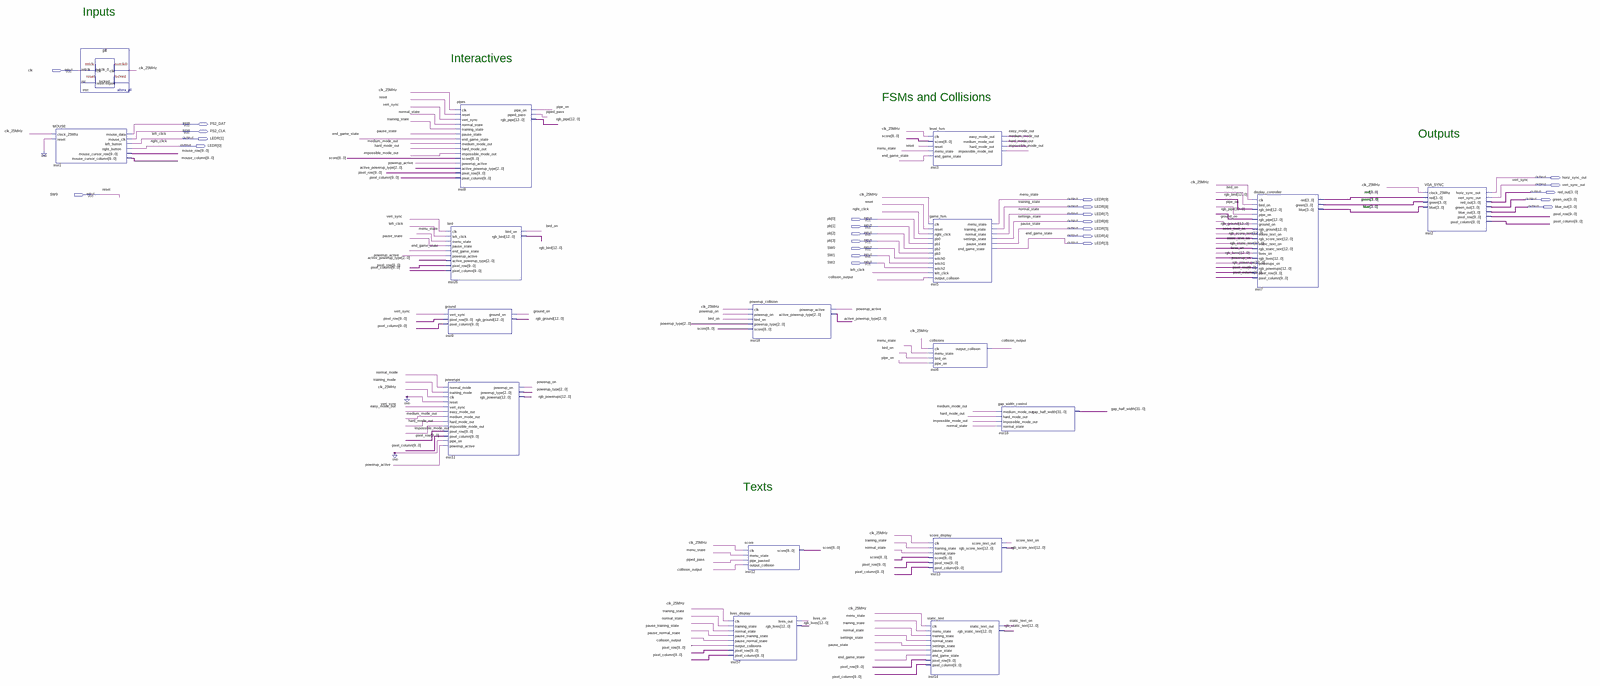
[diagram p0: schematic sheet, whole]
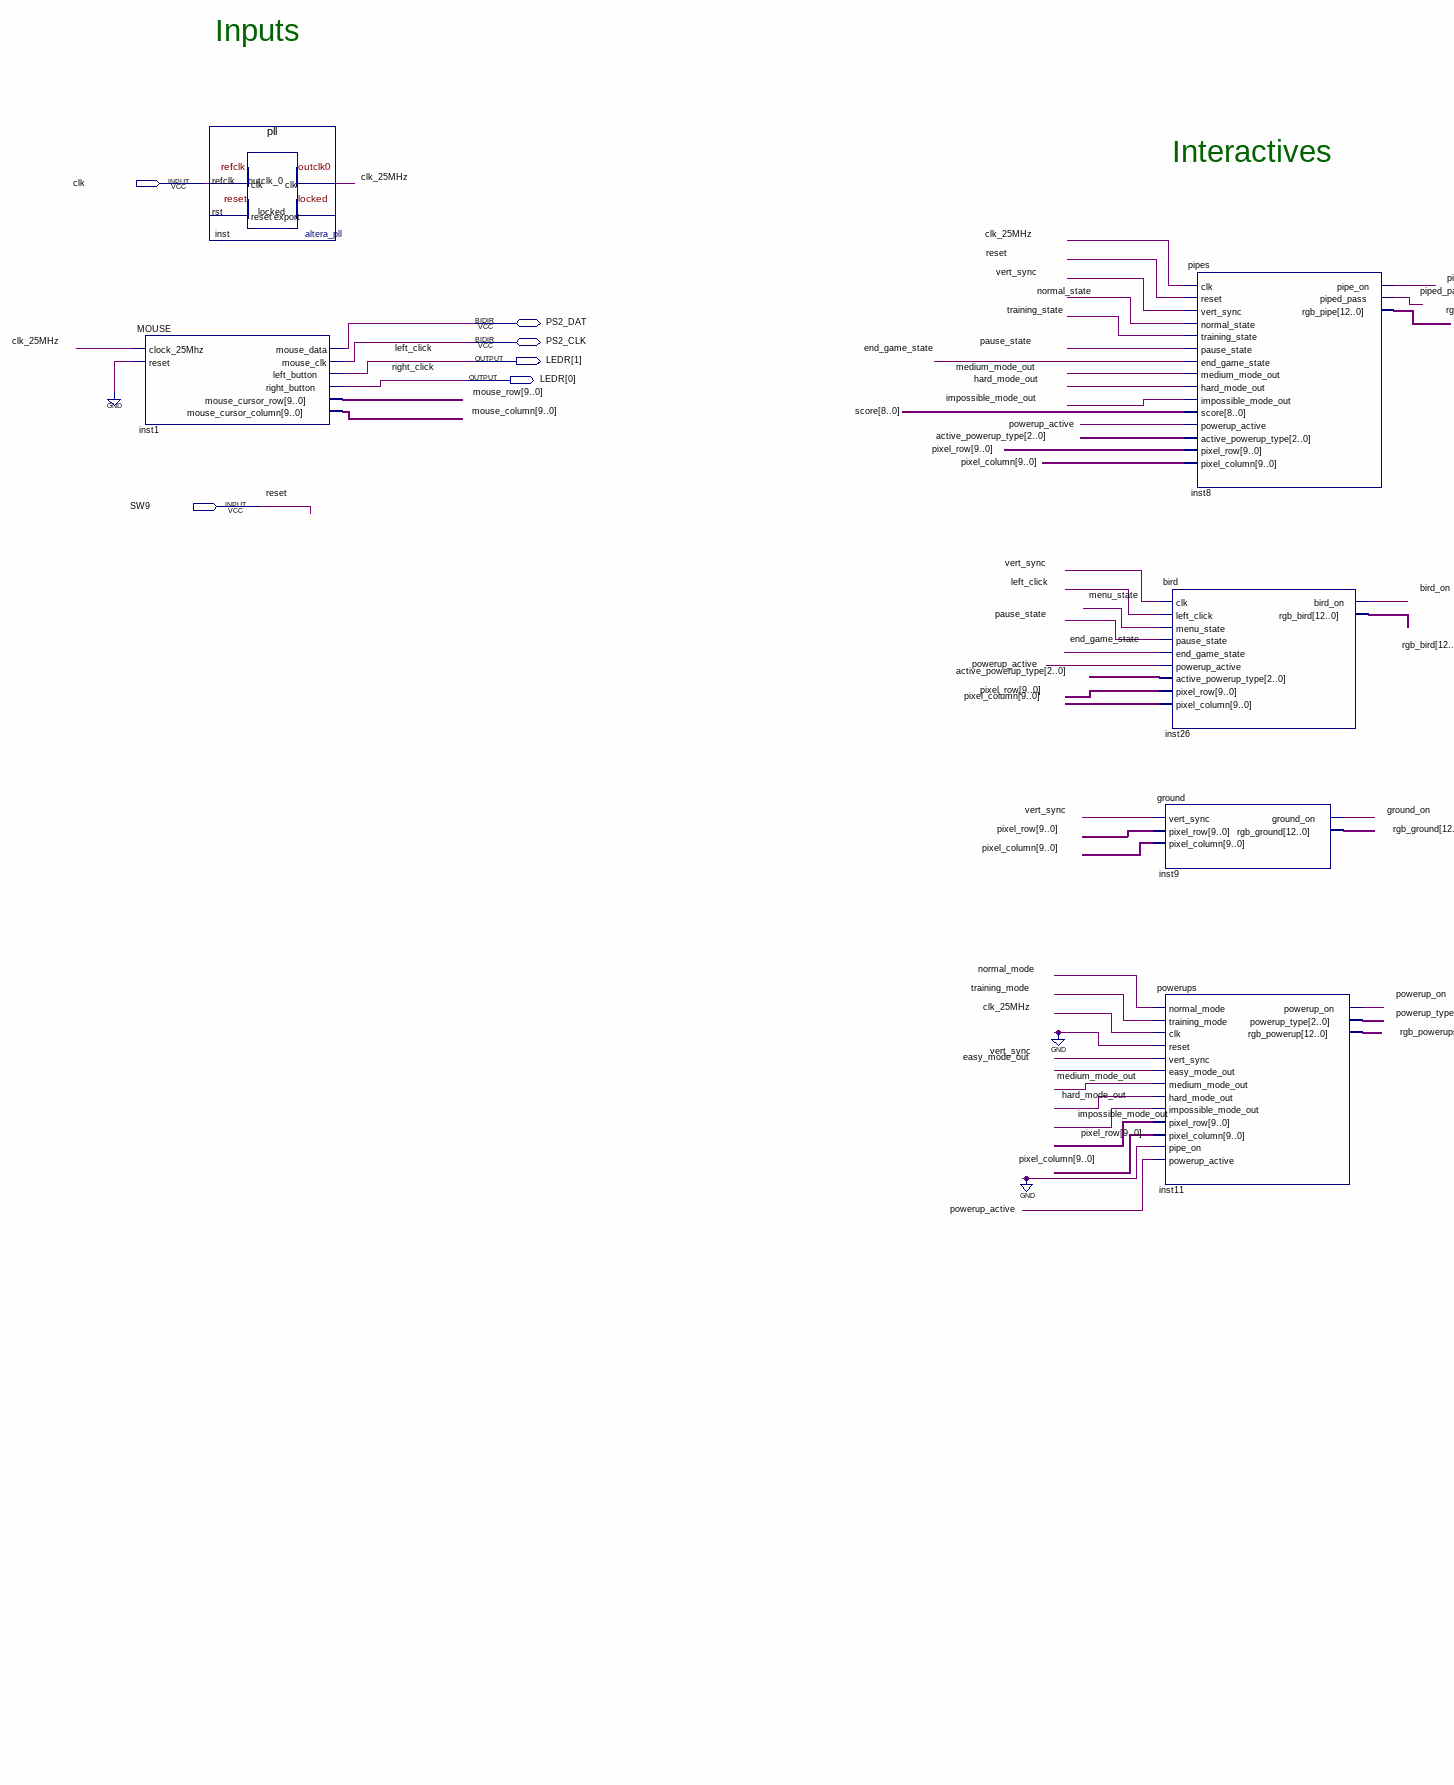
[diagram p1: schematic sheet, left part]
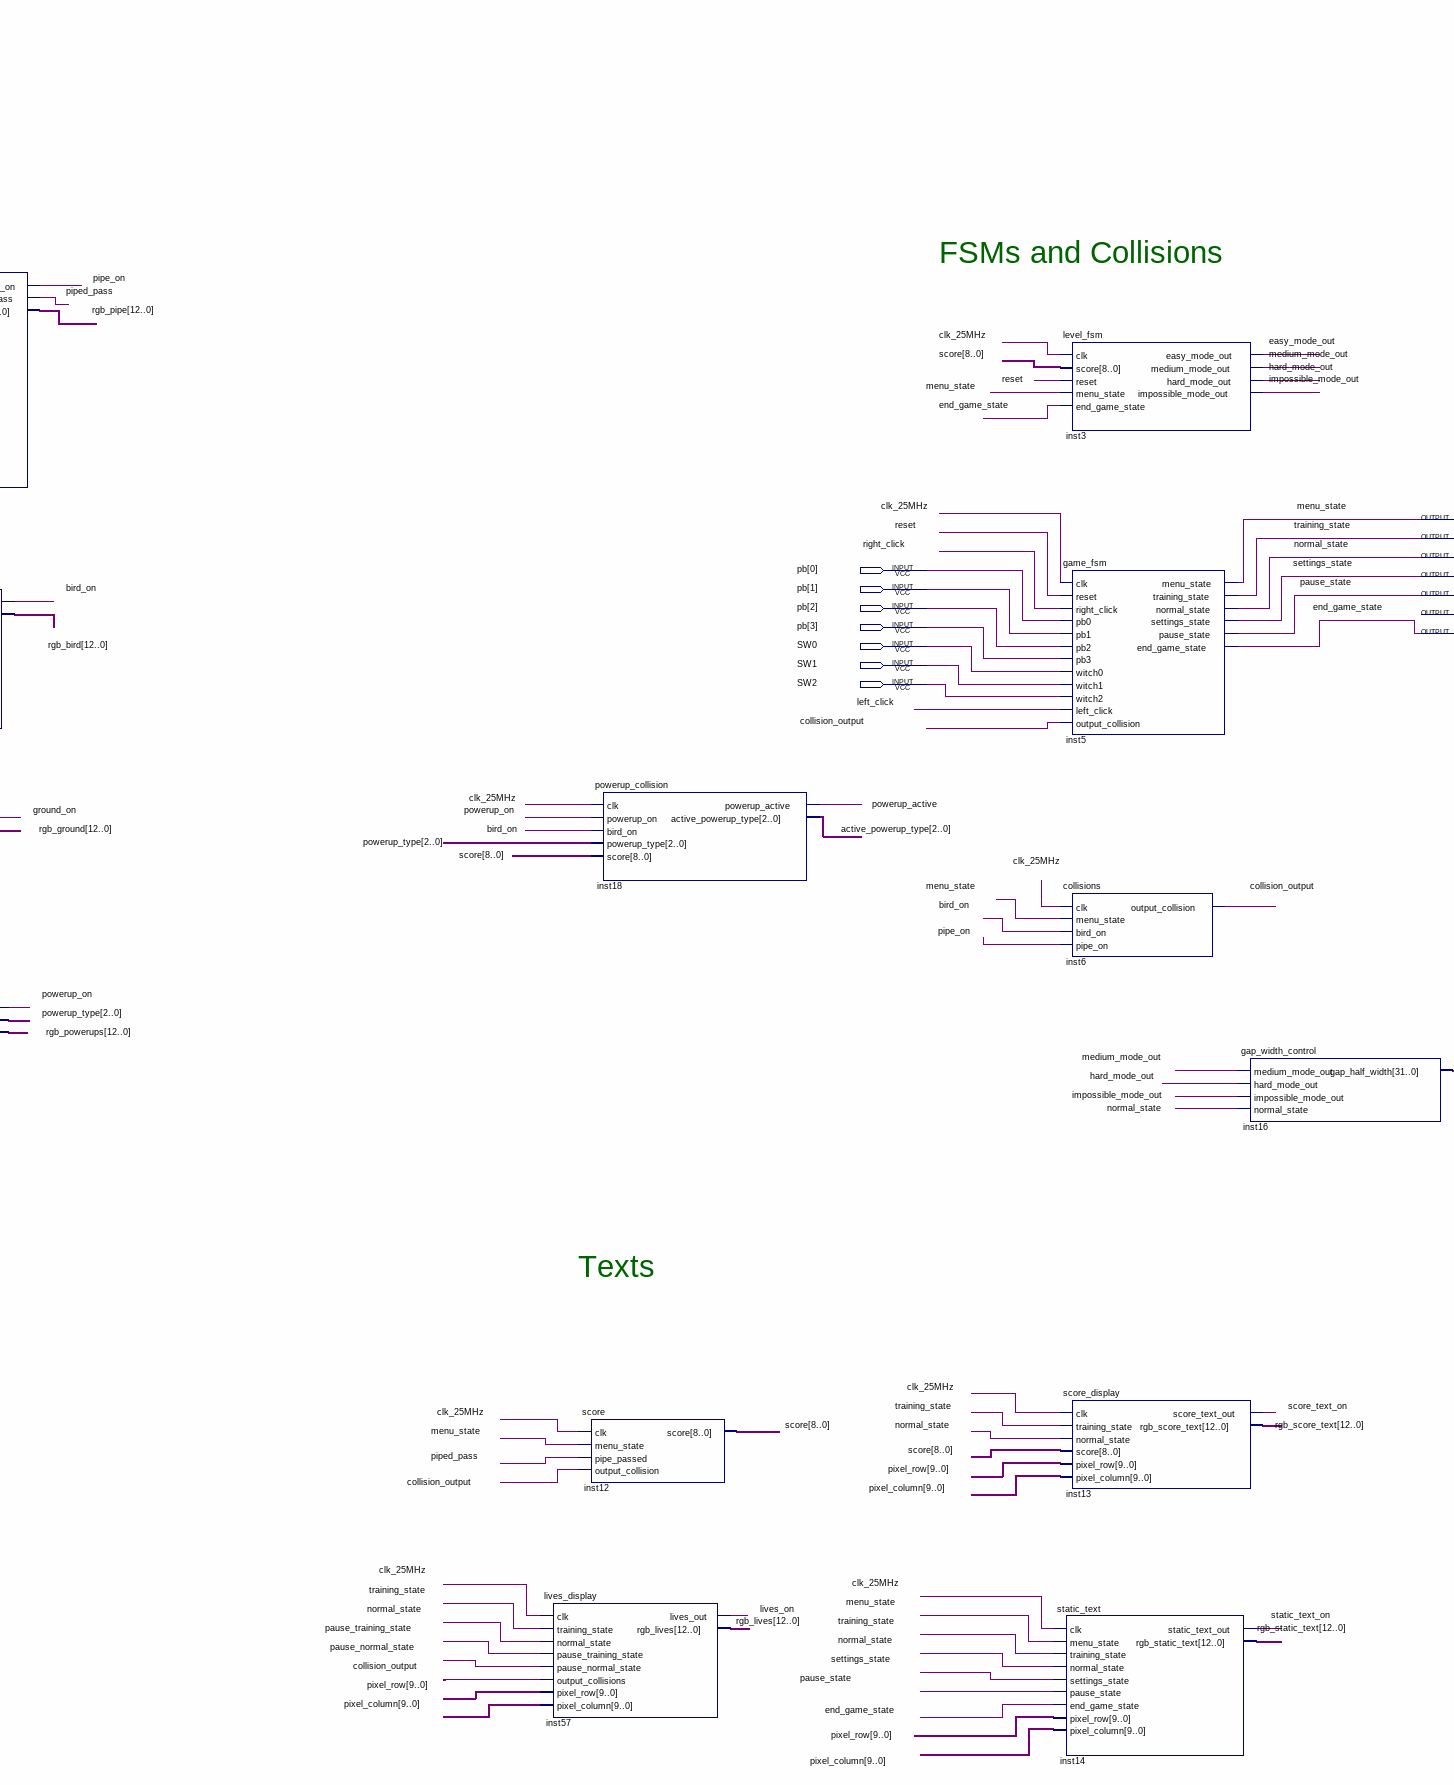
[diagram p2: schematic sheet, centre part]
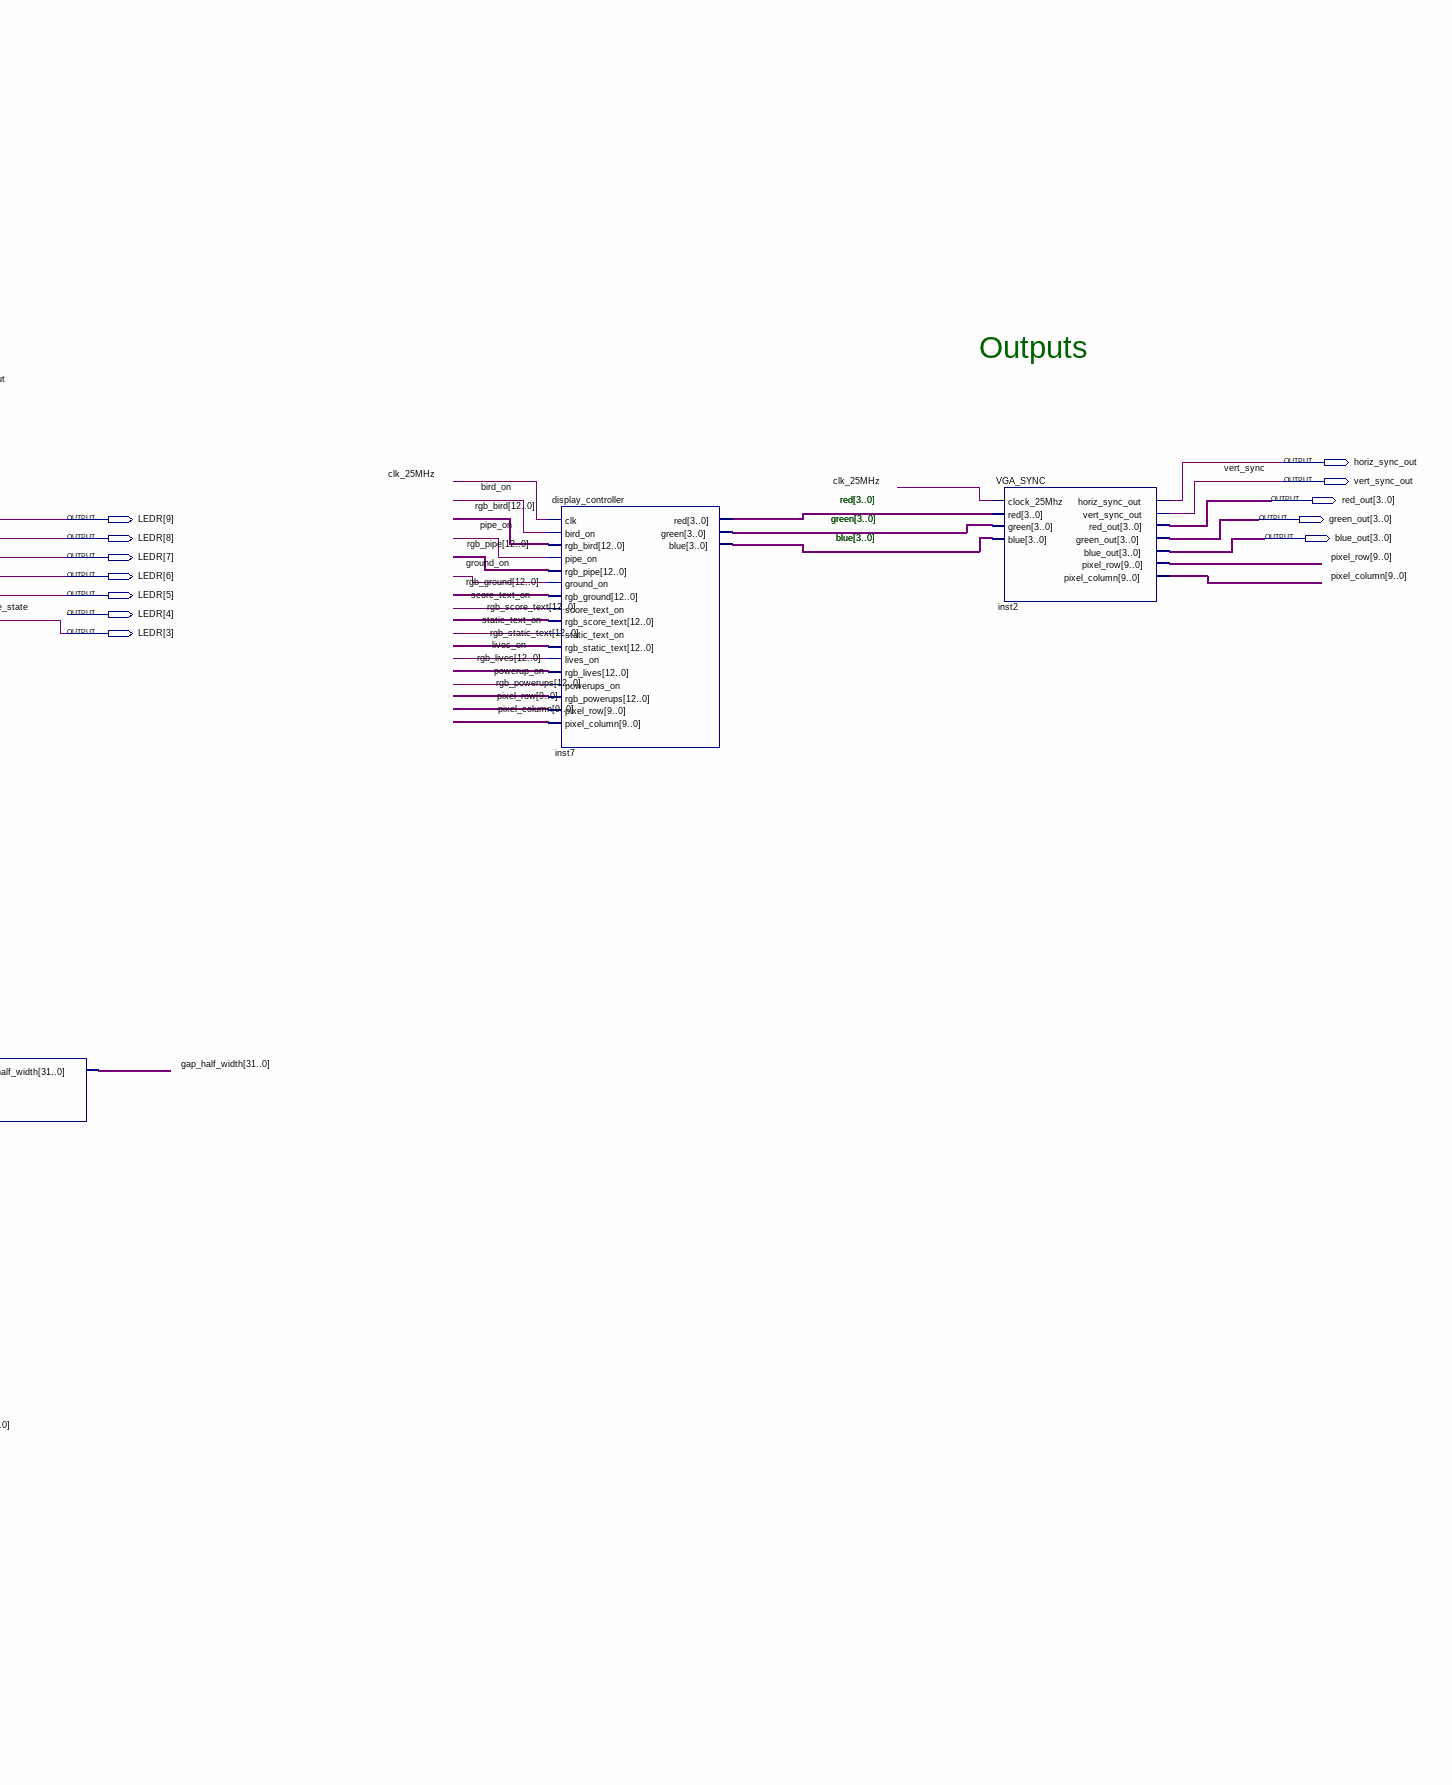
[diagram p3: schematic sheet, right part]
// Quartus schematic flappybird.bdf as structural Verilog: 17 symbols, 25 pins
module flappybird (
  input  clk,
  input  SW9,
  input  [3:0] pb,
  input  SW0,
  input  SW1,
  input  SW2,
  inout  PS2_DAT,
  inout  PS2_CLK,
  output [9:0] LEDR,
  output horiz_sync_out,
  output vert_sync_out,
  output [3:0] red_out,
  output [3:0] green_out,
  output [3:0] blue_out
);

  wire bird_on, clk_25MHz, collision_output, easy_mode_out, ground_on, hard_mode_out, impossible_mode_out,
       lives_on, medium_mode_out, normal_mode, pause_normal_state, pause_training_state, pipe_on, piped_pass,
       powerup_active, powerup_on, score_text_on, static_text_on, training_mode;
  wire [2:0] active_powerup_type, powerup_type;
  wire [3:0] blue, green, red;
  wire [8:0] score;
  wire [9:0] mouse_column, mouse_row, pixel_column, pixel_row;
  wire [12:0] rgb_bird, rgb_ground, rgb_lives, rgb_pipe, rgb_powerups, rgb_score_text, rgb_static_text;
  wire [31:0] gap_half_width;

  MOUSE inst1 (
    .clock_25Mhz(clk_25MHz), .reset(1'b0), .left_button(LEDR[1]), .right_button(LEDR[0]),
    .mouse_cursor_row(mouse_row), .mouse_cursor_column(mouse_column), .mouse_data(PS2_DAT),
    .mouse_clk(PS2_CLK));
  pll inst (.refclk(clk), .outclk_0(clk_25MHz));  // open: rst, locked
  pipes inst8 (
    .clk(clk_25MHz), .reset(SW9), .vert_sync(vert_sync_out), .normal_state(LEDR[7]),
    .training_state(LEDR[8]), .pause_state(LEDR[5]), .end_game_state(LEDR[3]),
    .medium_mode_out(medium_mode_out), .hard_mode_out(hard_mode_out),
    .impossible_mode_out(impossible_mode_out), .score(score), .powerup_active(powerup_active),
    .active_powerup_type(active_powerup_type), .pixel_row(pixel_row), .pixel_column(pixel_column),
    .pipe_on(pipe_on), .piped_pass(piped_pass), .rgb_pipe(rgb_pipe));
  bird inst26 (
    .clk(vert_sync_out), .left_click(LEDR[1]), .menu_state(LEDR[9]), .pause_state(LEDR[5]),
    .end_game_state(LEDR[3]), .powerup_active(powerup_active), .active_powerup_type(active_powerup_type),
    .pixel_row(pixel_row), .pixel_column(pixel_column), .bird_on(bird_on), .rgb_bird(rgb_bird));
  ground inst9 (
    .vert_sync(vert_sync_out), .pixel_row(pixel_row), .pixel_column(pixel_column), .ground_on(ground_on),
    .rgb_ground(rgb_ground));
  powerups inst11 (
    .normal_mode(normal_mode), .training_mode(training_mode), .clk(clk_25MHz), .reset(1'b0),
    .vert_sync(vert_sync_out), .easy_mode_out(easy_mode_out), .medium_mode_out(medium_mode_out),
    .hard_mode_out(hard_mode_out), .impossible_mode_out(impossible_mode_out), .pixel_row(pixel_row),
    .pixel_column(pixel_column), .pipe_on(1'b0), .powerup_active(powerup_active), .powerup_on(powerup_on),
    .powerup_type(powerup_type), .rgb_powerup(rgb_powerups));
  lives_display inst57 (
    .clk(clk_25MHz), .training_state(LEDR[8]), .normal_state(LEDR[7]),
    .pause_training_state(pause_training_state), .pause_normal_state(pause_normal_state),
    .output_collisions(collision_output), .pixel_row(pixel_row), .pixel_column(pixel_column),
    .lives_out(lives_on), .rgb_lives(rgb_lives));
  powerup_collision inst18 (
    .clk(clk_25MHz), .powerup_on(powerup_on), .bird_on(bird_on), .powerup_type(powerup_type), .score(score),
    .powerup_active(powerup_active), .active_powerup_type(active_powerup_type));
  score inst12 (
    .clk(clk_25MHz), .menu_state(LEDR[9]), .pipe_passed(piped_pass), .output_collision(collision_output),
    .score(score));
  level_fsm inst3 (
    .clk(clk_25MHz), .score(score), .reset(SW9), .menu_state(LEDR[9]), .end_game_state(LEDR[3]),
    .easy_mode_out(easy_mode_out), .medium_mode_out(medium_mode_out), .hard_mode_out(hard_mode_out),
    .impossible_mode_out(impossible_mode_out));
  game_fsm inst5 (
    .clk(clk_25MHz), .reset(SW9), .right_click(LEDR[0]), .pb0(pb[0]), .pb1(pb[1]), .pb2(pb[2]), .pb3(pb[3]),
    .witch0(SW0), .witch1(SW1), .witch2(SW2), .left_click(LEDR[1]), .output_collision(collision_output),
    .menu_state(LEDR[9]), .training_state(LEDR[8]), .normal_state(LEDR[7]), .settings_state(LEDR[6]),
    .pause_state(LEDR[5]), .end_game_state(LEDR[3]));
  collisions inst6 (
    .clk(clk_25MHz), .menu_state(LEDR[9]), .bird_on(bird_on), .pipe_on(pipe_on),
    .output_collision(collision_output));
  score_display inst13 (
    .clk(clk_25MHz), .training_state(LEDR[8]), .normal_state(LEDR[7]), .score(score), .pixel_row(pixel_row),
    .pixel_column(pixel_column), .score_text_out(score_text_on), .rgb_score_text(rgb_score_text));
  static_text inst14 (
    .clk(clk_25MHz), .menu_state(LEDR[9]), .training_state(LEDR[8]), .normal_state(LEDR[7]),
    .settings_state(LEDR[6]), .pause_state(LEDR[5]), .end_game_state(LEDR[3]), .pixel_row(pixel_row),
    .pixel_column(pixel_column), .static_text_out(static_text_on), .rgb_static_text(rgb_static_text));
  gap_width_control inst16 (
    .medium_mode_out(medium_mode_out), .hard_mode_out(hard_mode_out),
    .impossible_mode_out(impossible_mode_out), .normal_state(LEDR[7]), .gap_half_width(gap_half_width));
  display_controller inst7 (
    .clk(clk_25MHz), .bird_on(bird_on), .rgb_bird(rgb_bird), .pipe_on(pipe_on), .rgb_pipe(rgb_pipe),
    .ground_on(ground_on), .rgb_ground(rgb_ground), .score_text_on(score_text_on),
    .rgb_score_text(rgb_score_text), .static_text_on(static_text_on), .rgb_static_text(rgb_static_text),
    .lives_on(lives_on), .rgb_lives(rgb_lives), .powerups_on(powerup_on), .rgb_powerups(rgb_powerups),
    .pixel_row(pixel_row), .pixel_column(pixel_column), .red(red), .green(green), .blue(blue));
  VGA_SYNC inst2 (
    .clock_25Mhz(clk_25MHz), .red(red), .green(green), .blue(blue), .horiz_sync_out(horiz_sync_out),
    .vert_sync_out(vert_sync_out), .red_out(red_out), .green_out(green_out), .blue_out(blue_out),
    .pixel_row(pixel_row), .pixel_column(pixel_column));

  // Other names for the same wires on the sheet: end_game_state = LEDR[3]; pause_state = LEDR[5];
  //   left_click = LEDR[1]; menu_state = LEDR[9]; normal_state = LEDR[7]; reset = SW9; right_click = LEDR[0];
  //   settings_state = LEDR[6]; training_state = LEDR[8]; vert_sync = vert_sync_out

  // Notes on the sheet:
  //   Inputs
  //   Interactives
  //   FSMs and Collisions
  //   Outputs
  //   red[3..0]
  //   green[3..0]
  //   blue[3..0]
  //   Texts
endmodule
